# EAGLE design Ali CC Regolabile OpAmp(PNP) (EAGLE 7.2.0)
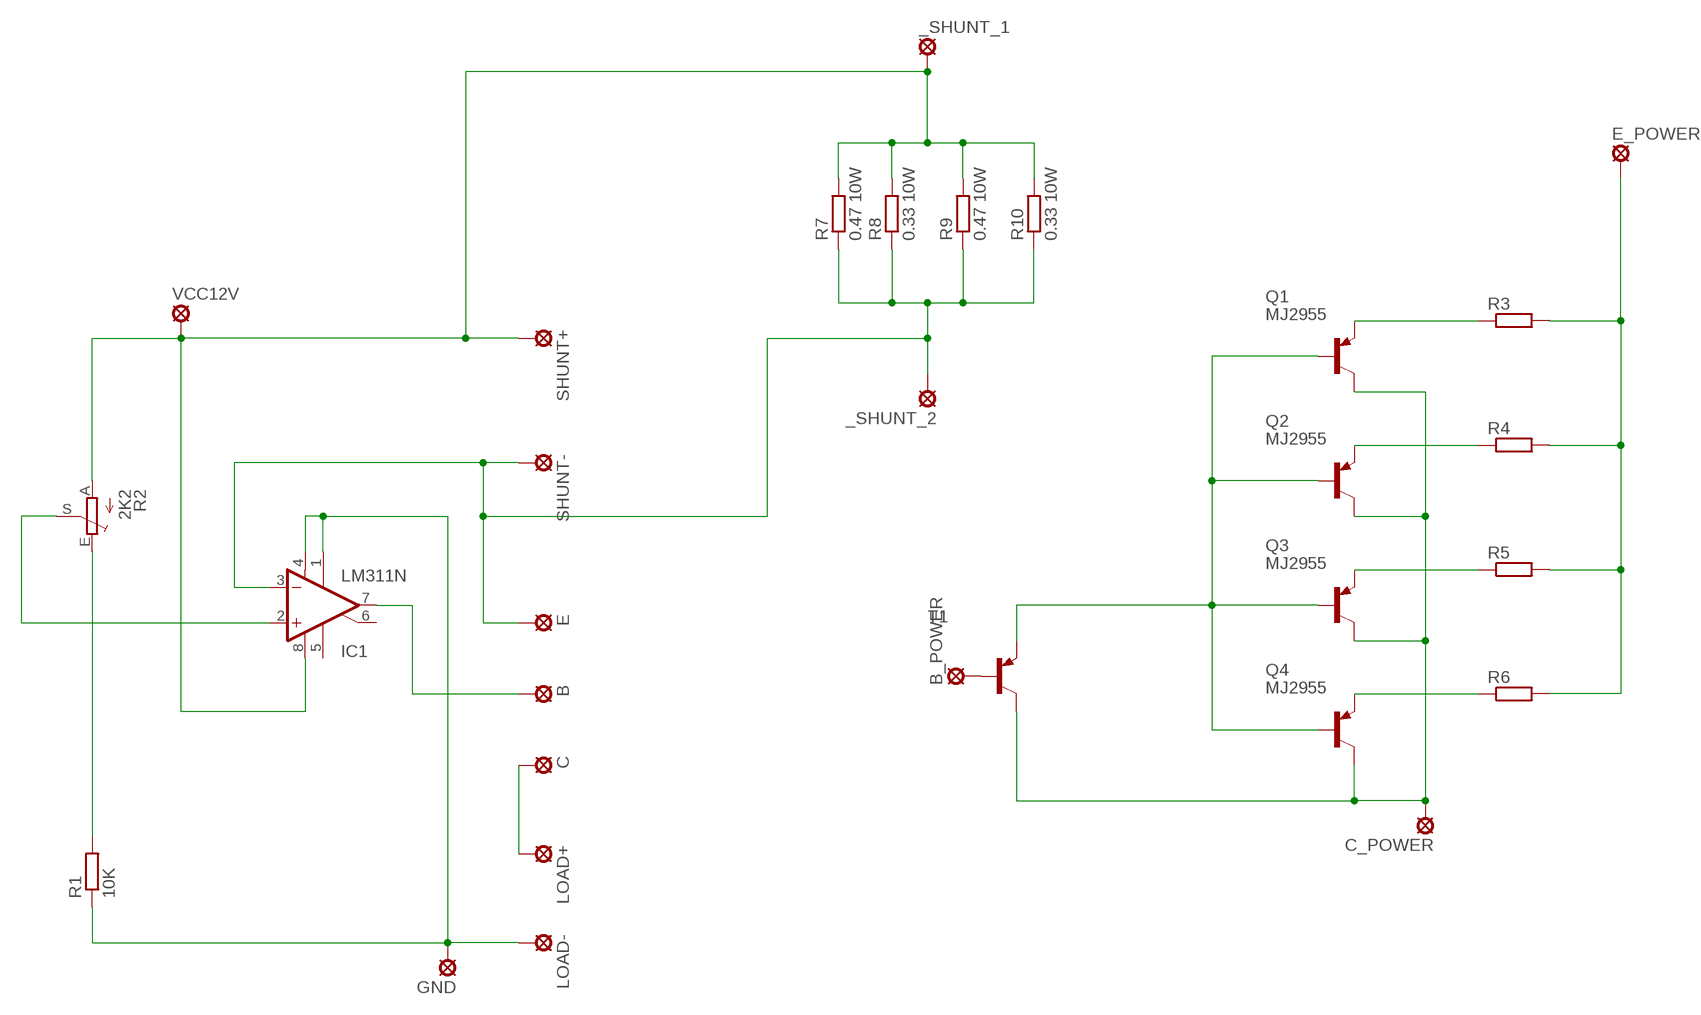
[diagram p0: schematic, sheet 1]

## Parts
_SHUNT_1  LSP10  [LSP10]
_SHUNT_2  LSP10  [LSP10]
B  SE14  [SE14]
B_POWER  LSP10  [LSP10]
C  SE14  [SE14]
C_POWER  LSP10  [LSP10]
E  SE14  [SE14]
E_POWER  LSP10  [LSP10]
GND  SE14  [SE14]
IC1  LM311N  [DIL08]
LOAD+  SE14  [SE14]
LOAD-  SE14  [SE14]
Q1  MJ2955  [TO3]
Q2  MJ2955  [TO3]
Q3  MJ2955  [TO3]
Q4  MJ2955  [TO3]
R1  10K  R-EU_0207/15  [0207/15]
R2  2K2  TRIM_EU-CIP20C-6MM  [CIP20C-6MM]
R3  R-EU_VTA53  [VTA53]
R4  R-EU_VTA53  [VTA53]
R5  R-EU_VTA53  [VTA53]
R6  R-EU_VTA53  [VTA53]
R7  0.47 10W  R-EU_VTA53  [VTA53]
R8  0.33 10W  R-EU_VTA53  [VTA53]
R9  0.47 10W  R-EU_VTA53  [VTA53]
R10  0.33 10W  R-EU_VTA53  [VTA53]
SHUNT+  SE14  [SE14]
SHUNT-  SE14  [SE14]
T1  BC558A-PNP-TO92-EBC  [TO92-EBC]
VCC12V  SE14  [SE14]

## Nets
N$1: _SHUNT_2.MP E.MP IC1.3(-IN) R7.1 R8.1 R9.1 R10.1 SHUNT-.MP
N$2: B.MP IC1.7(OUT)
N$3: C.MP LOAD+.MP
N$4: GND.MP IC1.1(GND) IC1.4(V-) LOAD-.MP R1.1
N$6: R1.2 R2.E
N$7: Q1.E R3.1
N$8: IC1.2(+IN) R2.S
N$9: Q2.E R4.1
N$10: Q3.E R5.1
N$11: Q4.E R6.1
N$12: E_POWER.MP R3.2 R4.2 R5.2 R6.2
N$13: C_POWER.MP Q1.C Q1.C/(C) Q2.C Q2.C/(C) Q3.C Q3.C/(C) Q4.C Q4.C/(C) T1.C
N$14: Q1.B Q2.B Q3.B Q4.B T1.E
N$15: B_POWER.MP T1.B
N$17: _SHUNT_1.MP IC1.8(V+) R2.A R7.2 R8.2 R9.2 R10.2 SHUNT+.MP VCC12V.MP
Unconnected: IC1.5(ON) IC1.6(ON/STR)

## Library data of the parts
_SHUNT_1 _SHUNT_2 B_POWER C_POWER E_POWER = solpad:LSP10: SOLDER PAD drill 1.0 mm, distributor Buerklin, 12H555
B C E GND LOAD+ LOAD- SHUNT+ SHUNT- VCC12V = solpad:SE14: SOLDER PAD E1553, drill 1,4mm, distributor Buerklin, 07F820
IC1 = linear:LM311: COMPARATOR
Q1-Q4 = transistor-pnp:MJ2955: PNP Transistor
R1 R3-R10 = rcl:R-EU_: RESISTOR, European symbol
R2 = pot:TRIM_EU-: POTENTIOMETER
T1 = transistor:*-PNP-: PNP Transistror

## Board
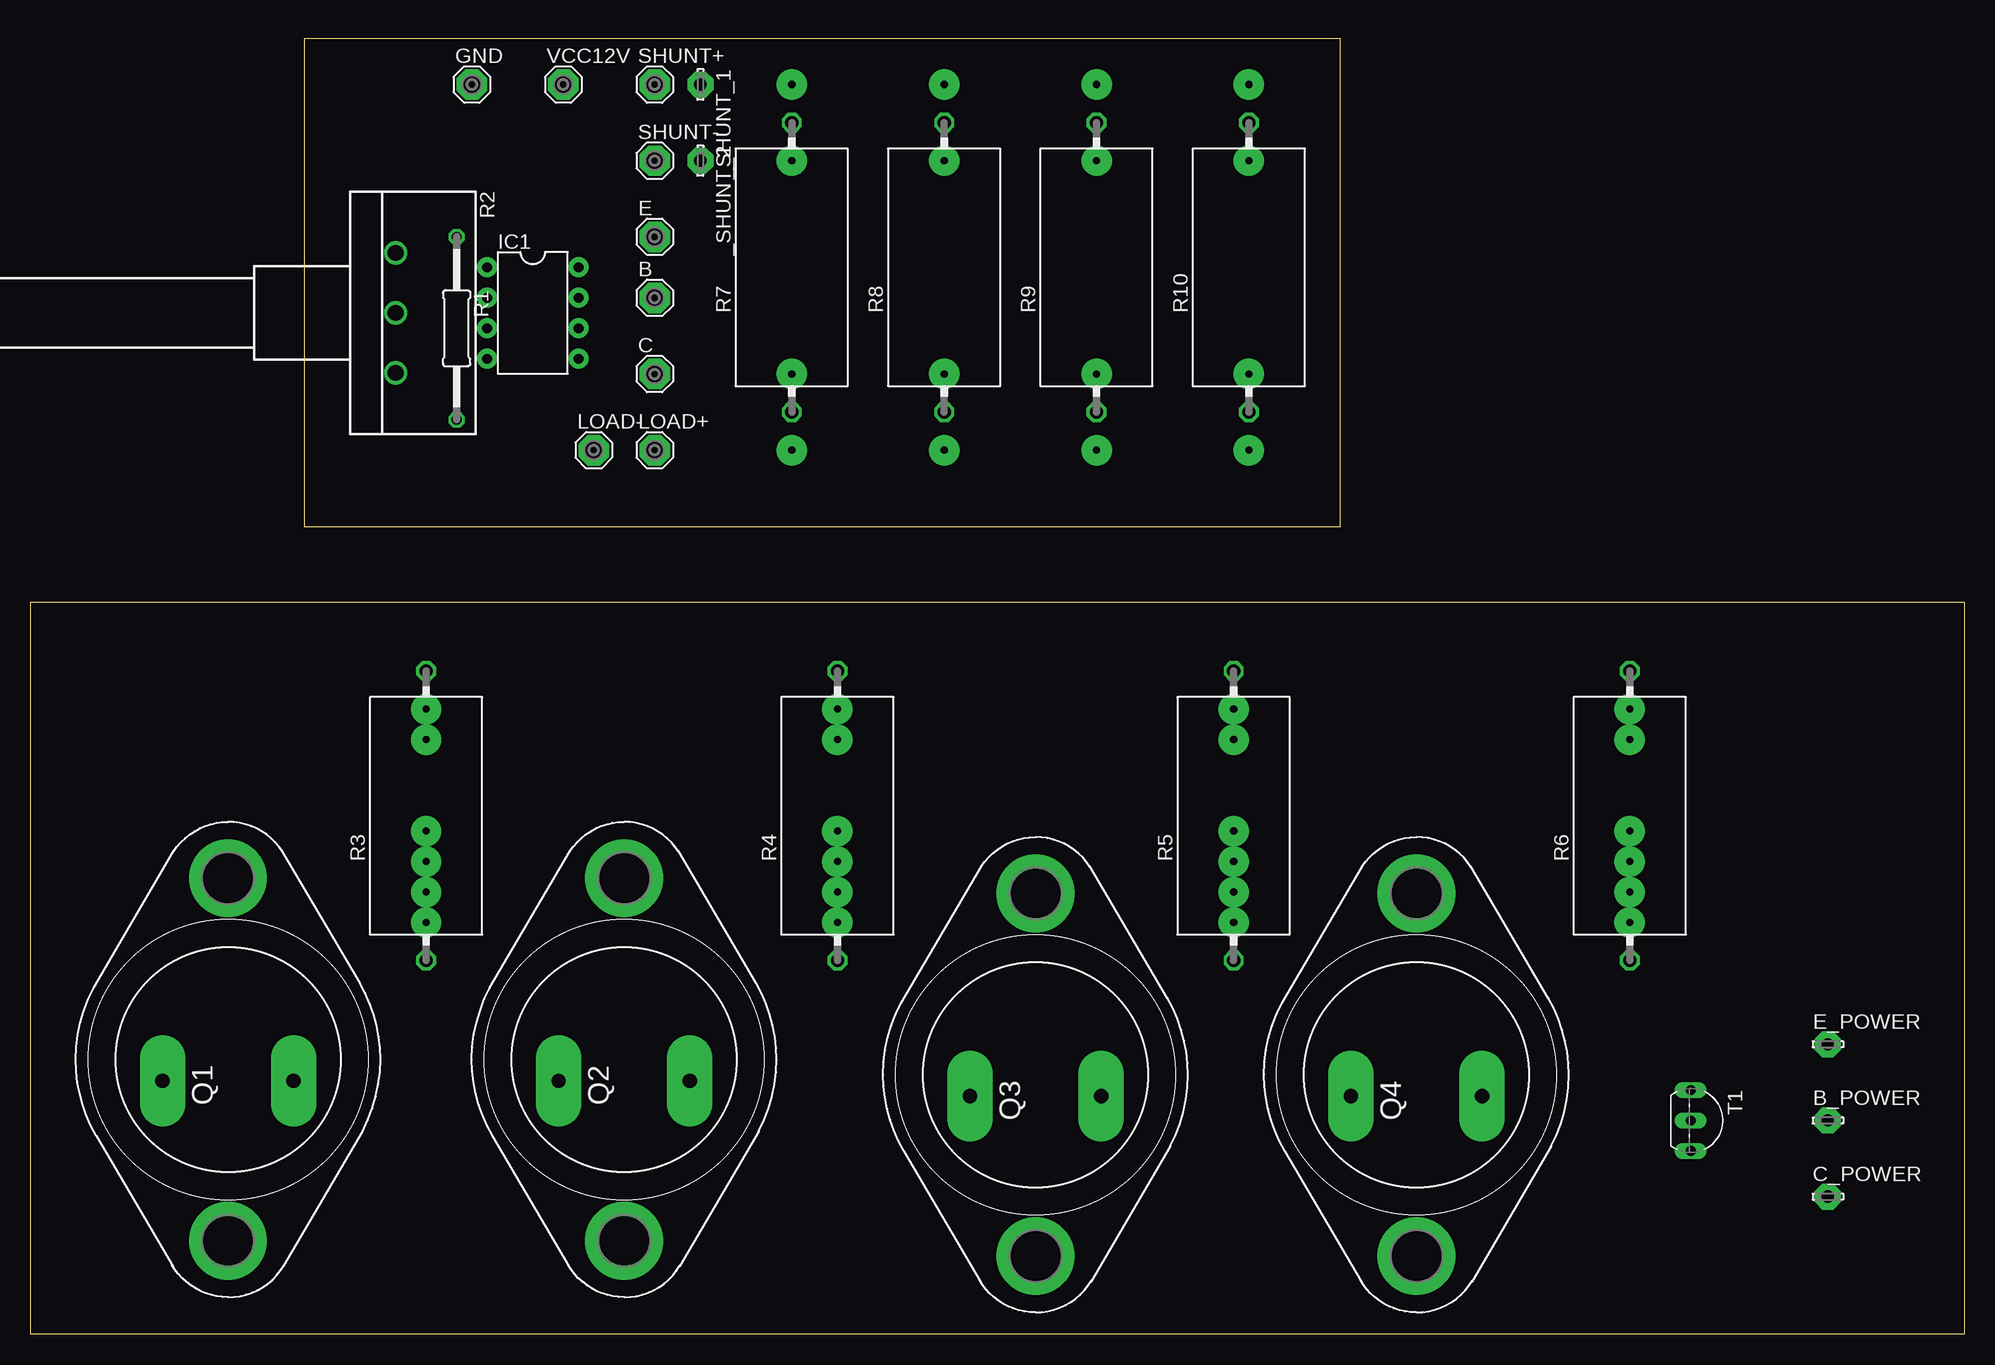
[diagram p1: board, top side]
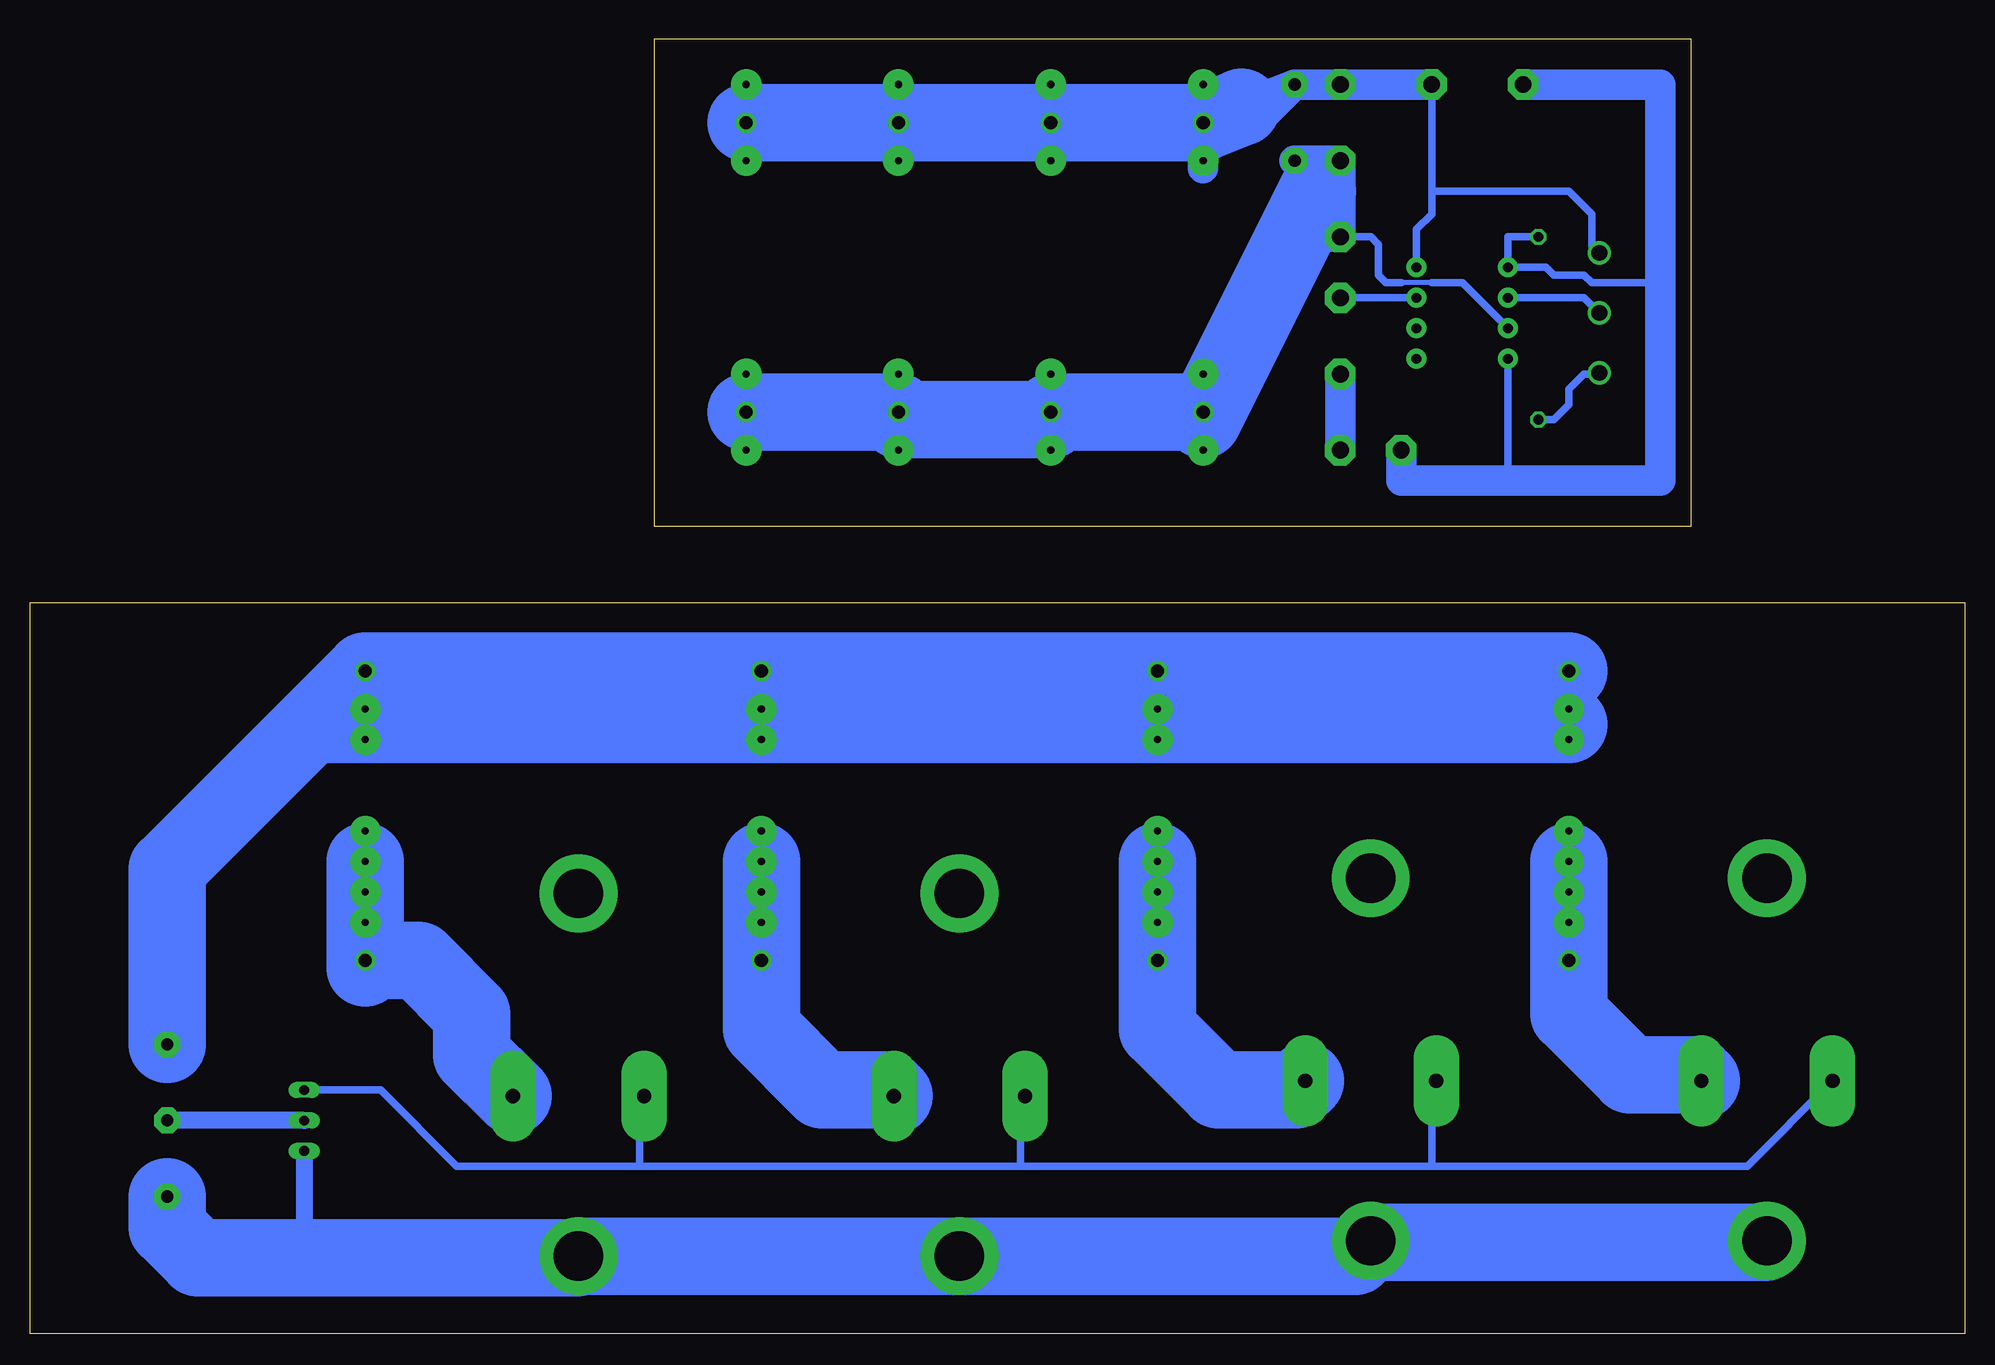
[diagram p2: board, bottom side, seen from below]

Size 161.29 x 107.95 mm. Coordinates in mm from the lower left corner, seen from the top.
Outline: 161.29,0 161.29,60.96 0,60.96 0,0 161.29,0
Outline: 22.86,107.95 22.86,67.31 109.22,67.31 109.22,107.95 22.86,107.95
Copper layers (1*16): Top 0.035mm / dielectric 1.5mm / Bottom 0.035mm
Design rules "default": minimum track width 10mil, minimum drill 24mil, track to track 8mil, track to pad 8mil, pad to pad 8mil, via to via 8mil, smd to smd 8mil, copper to edge 40mil, drill to drill 8mil, minimum pad ring 10mil, minimum via ring 8mil, stop-mask expansion 4mil, vias tented up to drill 0mil, thermal gap 10mil

### Footprints (pad centres in the part's own frame; a part is rotated, then mirrored left to right if it is on the bottom)
LSP10 = drill 1.016 pad 2.159 octagon: MP 0,0
SE14 = drill 1.397 pad 2.54 octagon: MP 0,0
DIL08 = drill 0.813 pad 1.676: 1 -3.81,-3.81; 2 -1.27,-3.81; 3 1.27,-3.81; 4 3.81,-3.81; 5 3.81,3.81; 6 1.27,3.81; 7 -1.27,3.81; 8 -3.81,3.81
TO3 = drill 1.194 pad 3.81 long: B -1.778,5.461; E -1.778,-5.461 | drill 4.115 pad 6.477: C 15.113,0; C/ -15.113,0
0207/15 = drill 0.813 octagon: 1 -7.62,0; 2 7.62,0
CIP20C-6MM = drill 1.3 pad 1.93: A -5,0; E 5,0; S 0,0
VTA53 = drill 1.1 octagon: 1 -12.065,0; 2 12.065,0
TO92-EBC = drill 0.813 long: B 0,-1.27; C 2.54,-1.27; E -2.54,-1.27

### Placement (x,y rotation side)
_SHUNT_1  55.88,104.14 270 top
_SHUNT_2  55.88,97.79 270 top
B  52.07,86.36 0 top
B_POWER  149.86,17.78 0 top
C  52.07,80.01 0 top
C_POWER  149.86,11.43 0 top
E  52.07,91.44 0 top
E_POWER  149.86,24.13 0 top
GND  36.83,104.14 0 top
IC1  41.91,85.09 270 top
LOAD+  52.07,73.66 0 top
LOAD-  46.99,73.66 0 top
Q1  16.51,22.86 90 top
Q2  49.53,22.86 90 top
Q3  83.82,21.59 90 top
Q4  115.57,21.59 90 top
R1  35.56,83.82 270 top
R2  30.48,85.09 270 top
R3  33.02,43.18 90 top
R4  67.31,43.18 90 top
R5  100.33,43.18 90 top
R6  133.35,43.18 90 top
R7  63.5,88.9 90 top
R8  76.2,88.9 90 top
R9  88.9,88.9 90 top
R10  101.6,88.9 90 top
SHUNT+  52.07,104.14 0 top
SHUNT-  52.07,97.79 0 top
T1  139.7,17.78 270 top
VCC12V  44.45,104.14 0 top

### Tracks (layer width: path | path; a pad name or v marks a point on that pad's centre or on a via)
N$1
  Bottom 0.406: 44.45,87.63 46.99,87.63
  Bottom 0.61: IC1.3 41.91,87.63 44.45,87.63 | E.MP 49.53,91.44 48.9,90.81 48.9,88.27 48.26,87.63 46.99,87.63
  Bottom 2.54: _SHUNT_2.MP SHUNT-.MP E.MP 55.25,91.44 55.25,89.53 59.06,85.72 59.06,81.28 R7.1 R8.1 R9.1 R10.1
N$2
  Bottom 0.61: IC1.7 B.MP
N$3
  Bottom 2.54: C.MP LOAD+.MP
N$4
  Bottom 0.61: R1.1 38.1,91.44 IC1.1 34.93,88.9 34.29,88.27 31.75,88.27 31.12,87.63 25.4,87.63 | IC1.4 38.1,71.12
  Bottom 2.54: LOAD-.MP 46.99,71.12 38.1,71.12 25.4,71.12 25.4,87.63 25.4,104.14 GND.MP
N$6
  Bottom 0.61: R2.E 30.56,80.01 31.75,80.01 33.02,78.74 33.02,77.47 34.29,76.2 R1.2
N$7
  Bottom 6.452: Q1.E 22.48,21.59 27.94,21.59 33.02,26.67 R3.1
N$8
  Bottom 0.61: R2.S 31.75,86.36 IC1.2
N$9
  Bottom 6.452: Q2.E 55.75,20.32 62.23,20.32 67.31,25.4 R4.1
N$10
  Bottom 6.452: Q3.E 89.79,20.32 95.25,20.32 100.33,25.4 R5.1
N$11
  Bottom 6.452: Q4.E 124.46,23.24 124.46,26.67 128.91,31.11 R6.1
N$12
  Bottom 6.452: R3.2 R4.2 R5.2 R6.2 149.86,38.73 E_POWER.MP
N$13
  Bottom 1.422: T1.C 138.43,6.35
  Bottom 6.452: Q1.C/ 16.64,7.62 49.53,7.62 Q2.C/ 50.8,6.48 Q3.C/ Q4.C/ 115.7,6.35 138.43,6.35 147.32,6.35 149.86,8.89 C_POWER.MP
N$14
  Bottom 0.61: Q1.B 18.16,13.97 44.45,13.97 | 44.45,13.97 78.74,13.97 | 78.74,13.97 110.49,13.97 | 110.49,13.97 125.73,13.97 132.08,20.32 T1.E | Q4.B 110.49,19.43 110.49,13.97 | Q3.B 78.74,19.43 78.74,13.97 | Q2.B 44.45,20.7 44.45,13.97
N$15
  Bottom 1.422: T1.B B_POWER.MP
N$16
  Bottom 6.452: 33.02,50.8 137.16,50.8
N$17  (via drill 0.6 pad 2.54)
  Bottom 0.61: VCC12V.MP 44.45,95.25 | 44.45,95.25 44.45,93.34 45.72,92.08 IC1.8 | R2.A 31.12,90.72 31.12,93.34 33.02,95.25 44.45,95.25
  Bottom 2.54: VCC12V.MP SHUNT+.MP _SHUNT_1.MP | v101.6,104.14 R10.2 | R10.2 v101.6,97.79 | v88.9,104.14 R9.2 | R9.2 88.9,100.33 | 88.9,100.33 v88.9,97.79 | v76.2,104.14 R8.2 | R8.2 v76.2,97.79 | v63.5,104.14 R7.2 | R7.2 63.5,97.16 | _SHUNT_1.MP 64.14,100.97 | _SHUNT_1.MP 59.06,100.97 R7.2 | R7.2 R8.2 | R8.2 76.84,100.33 88.9,100.33 | 88.9,100.33 89.53,100.97 | R9.2 R10.2 | R10.2 102.23,100.97
  Bottom 6.452: R10.2 89.53,100.97 R9.2 R8.2 64.14,100.97 R7.2 60.33,102.23
N$19  (via drill 0.6 pad 2.54)
  Bottom 6.452: 33.02,31.75 v33.02,34.29 v33.02,36.83 v33.02,39.37
N$20  (via drill 0.6 pad 2.54)
  Bottom 6.452: 67.31,31.75 v67.31,34.29 v67.31,36.83 v67.31,39.37
N$21  (via drill 0.6 pad 2.54)
  Bottom 6.452: 100.33,31.75 v100.33,34.29 v100.33,36.83 v100.33,39.37
N$22  (via drill 0.6 pad 2.54)
  Bottom 6.452: 133.35,30.48 v133.35,34.29 v133.35,36.83 v133.35,39.37
N$23  (via drill 0.6 pad 2.54)
  other vias: 33.02,41.91
N$24  (via drill 0.6 pad 2.54)
  other vias: 67.31,41.91
N$25  (via drill 0.6 pad 2.54)
  other vias: 100.33,41.91
N$26  (via drill 0.6 pad 2.54)
  other vias: 133.35,41.91
N$27  (via drill 0.6 pad 2.54)
  other vias: 133.35,52.07
N$28  (via drill 0.6 pad 2.54)
  other vias: 133.35,49.53
N$29  (via drill 0.6 pad 2.54)
  other vias: 100.33,52.07
N$30  (via drill 0.6 pad 2.54)
  other vias: 67.31,52.07
N$31  (via drill 0.6 pad 2.54)
  other vias: 33.02,52.07
N$32  (via drill 0.6 pad 2.54)
  other vias: 33.02,49.53
N$33  (via drill 0.6 pad 2.54)
  other vias: 67.31,49.53
N$34  (via drill 0.6 pad 2.54)
  other vias: 100.33,49.53
N$43  (via drill 0.6 pad 2.54)
  other vias: 63.5,97.79
N$47  (via drill 0.6 pad 2.54)
  Bottom 2.54: v101.6,80.01 101.6,76.84 v101.6,73.66 | v88.9,80.01 88.9,76.84 88.9,76.2 v88.9,73.66 | v76.2,80.01 76.2,76.84 v76.2,73.66 | v63.5,80.01 63.5,76.84 63.5,76.2 v63.5,73.66
  Bottom 6.452: 101.6,76.84 88.9,76.84 | 88.9,76.2 76.2,76.2 76.2,76.84 63.5,76.84 | 63.5,76.2 53.98,95.25